# EAGLE design skypic-2005 (EAGLE 4.09)
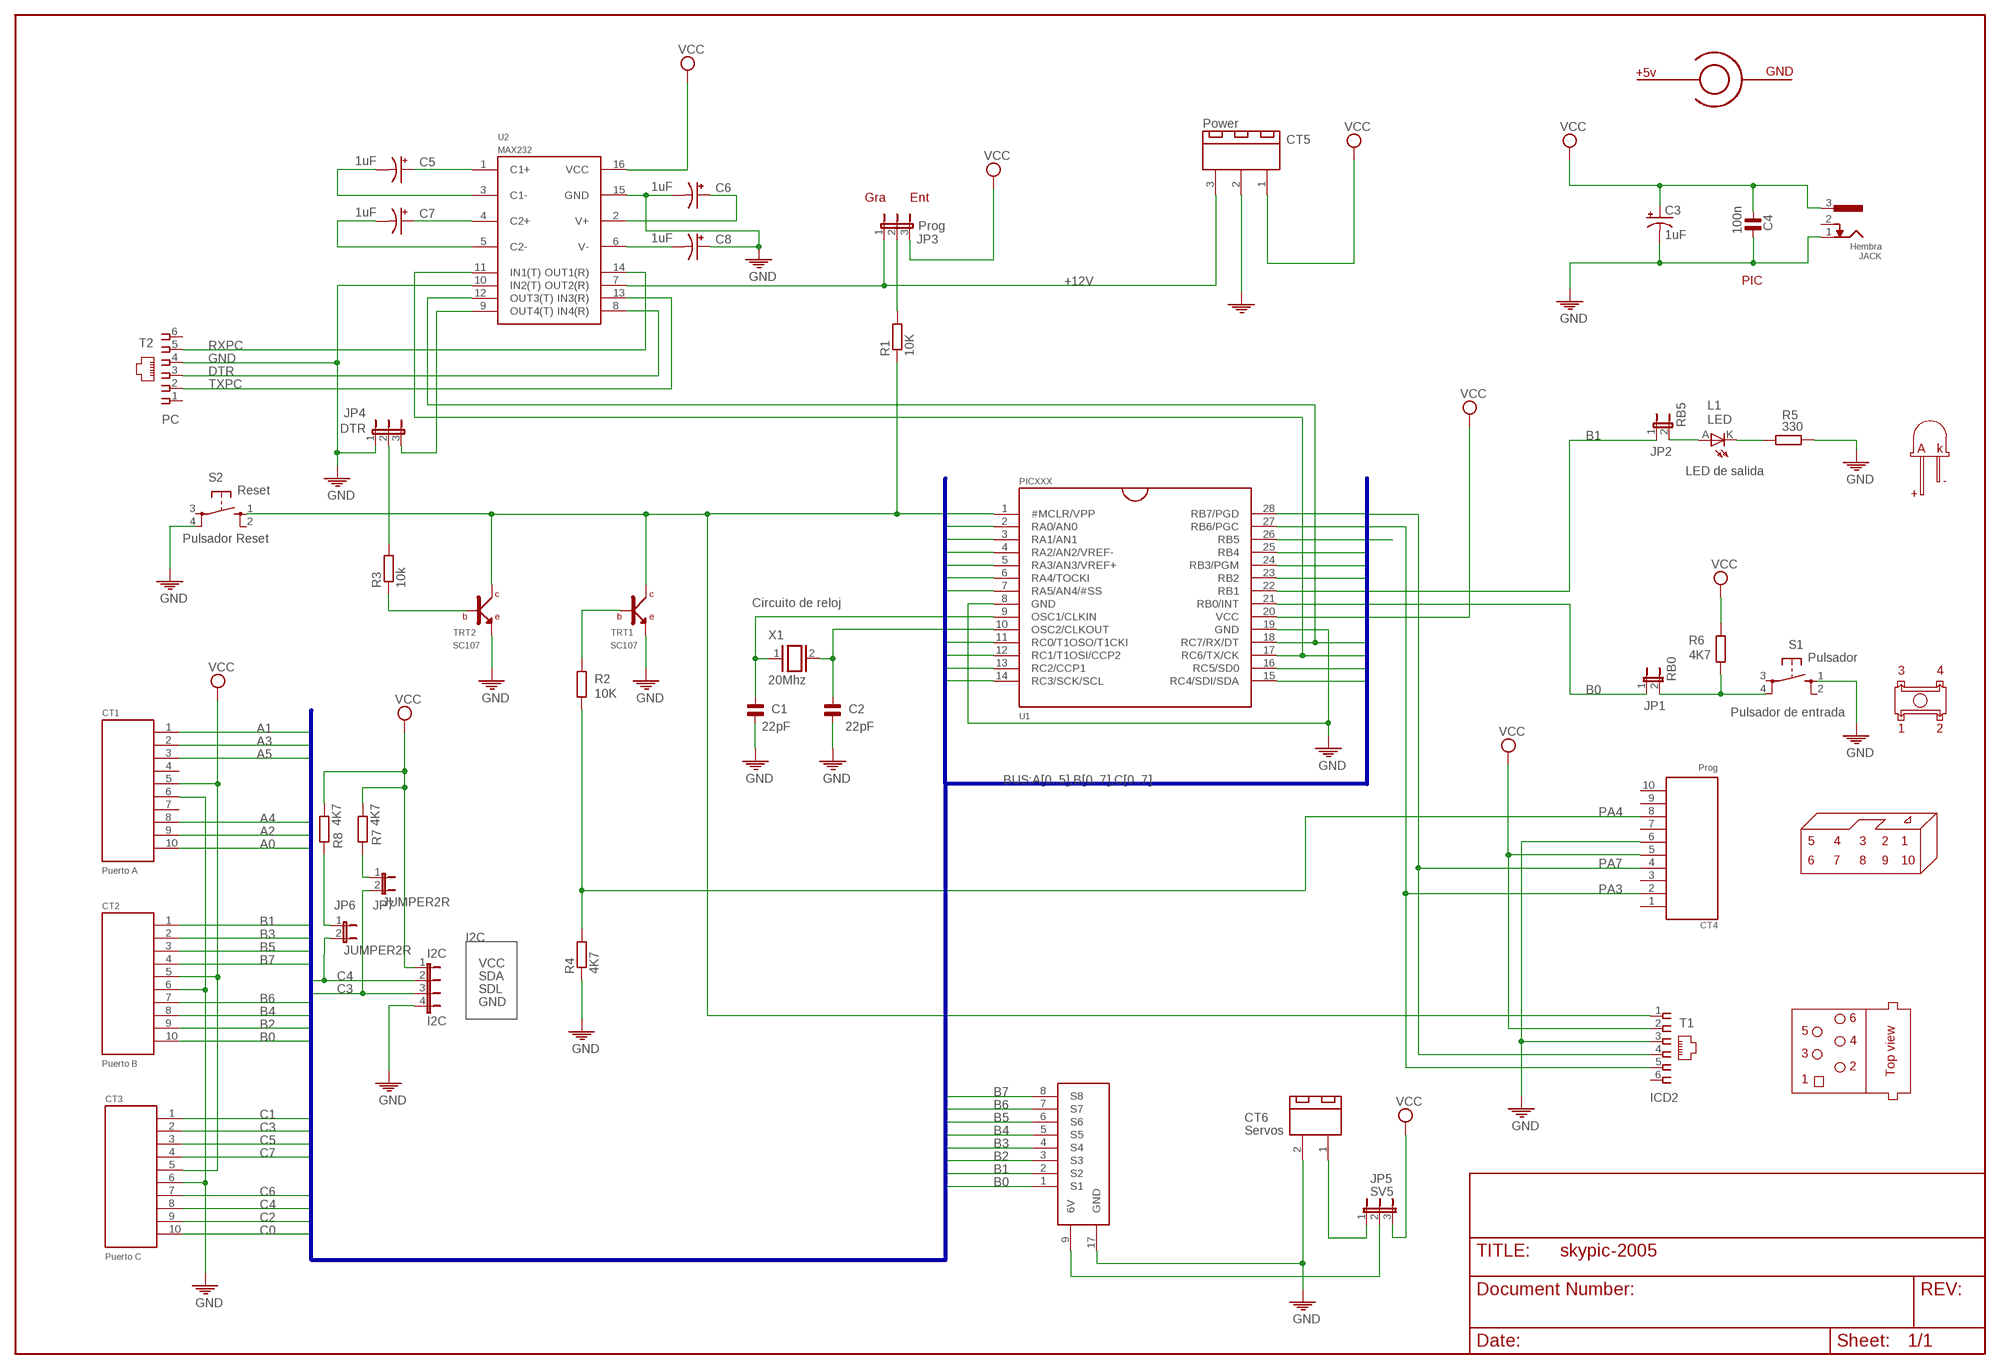
[diagram p0: schematic, sheet 1]

## Parts
C1  22pF  CON-MUL5  [C5]
C2  22pF  CON-MUL5  [C5]
C3  1uF  CPOL-USE2.5-6  [E2,5-6]
C4  100n  CON-MUL5  [C5]
C5  1uF  CPOL-USE2.5-6  [E2,5-6]
C6  1uF  CPOL-USE2.5-6  [E2,5-6]
C7  1uF  CPOL-USE2.5-6  [E2,5-6]
C8  1uF  CPOL-USE2.5-6  [E2,5-6]
CT1  Puerto A  CTCONA  [CTCON]
CT2  Puerto B  CTCONA  [CTCON]
CT3  Puerto C  CTCONA  [CTCON]
CT4  Prog  CTCONA  [CTCON]
CT5  Power  CLEMA3P  [C3P]
CT6  Servos  CLEMA2P  [C2P]
I2C  I2C  JUMPER4  [JP4R]
JACK  Hembra  JACKP  [JACK]
JP1  RB0  JUMPER2R  [JP2]
JP2  RB5  JUMPER2R  [JP2]
JP3  Prog  JUMPER3R  [JP3R]
JP4  DTR  JUMPER3R  [JP3R]
JP5  SV5  JUMPER3R  [JP3R]
JP6  JUMPER2R  [JP2]
JP7  JUMPER2R  [JP2]
L1  LED  LED3  [LED3MM]
PICXXX  U1  PIC16F876A  [DIL28]
R1  10K  RESISTENCIA10  [R207/10]
R2  10K  RESISTENCIA10  [R207/10]
R3  10k  RESISTENCIA10  [R207/10]
R4  4K7  RESISTENCIA10  [R207/10]
R5  330  RESISTENCIA10  [R207/10]
R6  4K7  RESISTENCIA10  [R207/10]
R7  4K7  RESISTENCIA10  [R207/10]
R8  4K7  RESISTENCIA10  [R207/10]
S1  Pulsador  PULSADORP  [PULSADOR-PEQUEÑO]
S2  Reset  PULSADORP  [PULSADOR-PEQUEÑO]
T1  ICD2  TEL6  [RJ11A]
T2  PC  TEL6  [RJ11A]
TRT1  SC107  SC107NPN  [TRT-NPN]
TRT2  SC107  SC107NPN  [TRT-NPN]
U2  MAX232  MAX232SDIP  [DIL16]
U$24  SERVOS8  [PAD8X3]
X1  20Mhz  XTALR  [XTAL-R]

## Nets
+12V: CT5.3 JP3.1 U2.7(OUT2(R))
A0: CT1.10 PICXXX.2(RA0/AN0)
A1: CT1.1 PICXXX.3(RA1/AN1)
A2: CT1.9 PICXXX.4(RA2/AN2/VREF-)
A3: CT1.2 PICXXX.5(RA3/AN3/VREF+)
A4: CT1.8 PICXXX.6(RA4/TOCKI)
A5: CT1.3 PICXXX.7(RA5/AN4/#SS)
B0: CT2.10 JP1.1 PICXXX.21(RB0/INT) U$24.1(S1)
B1: CT2.1 JP2.1 PICXXX.22(RB1) U$24.2(S2)
B2: CT2.9 PICXXX.23(RB2) U$24.3(S3)
B3: CT2.2 PICXXX.24(RB3/PGM) U$24.4(S4)
B4: CT2.8 PICXXX.25(RB4) U$24.5(S5)
B5: CT2.3 PICXXX.26(RB5) U$24.6(S6)
B6: CT2.7 CT4.2 PICXXX.27(RB6/PGC) T1.5 U$24.7(S7)
B7: CT2.4 CT4.4 PICXXX.28(RB7/PGD) T1.4 U$24.8(S8)
C0: CT3.10 PICXXX.11(RC0/T1OSO/T1CKI)
C1: CT3.1 PICXXX.12(RC1/T1OSI/CCP2)
C2: CT3.9 PICXXX.13(RC2/CCP1)
C3: CT3.2 I2C.3 JP7.2 PICXXX.14(RC3/SCK/SCL)
C4: CT3.8 I2C.2 JP6.2 PICXXX.15(RC4/SDI/SDA)
C5: CT3.3 PICXXX.16(RC5/SD0)
C6: CT3.7 PICXXX.17(RC6/TX/CK) U2.11(IN1(T))
C7: CT3.4 PICXXX.18(RC7/RX/DT) U2.12(OUT3(T))
DTR: T2.3 U2.8(IN4(R))
GND: C1.1 C2.1 C3.- C4.1 C6.- C8.+ CT1.6 CT2.6 CT3.6 CT4.6 CT5.2 CT6.2 I2C.4 JACK.1 JP4.1 PICXXX.8(GND) PICXXX.19(GND) R4.1 R5.1 S1.1 S2.4 T1.3 T2.4 TRT1.E TRT2.E U2.10(IN2(T)) U2.15(GND) U$24.17(GND)
N$1: C2.2 PICXXX.10(OSC2/CLKOUT) X1.2
N$2: JP7.1 R7.1
N$3: C1.2 PICXXX.9(OSC1/CLKIN) X1.1
N$4: JP1.2 R6.1 S1.4
N$5: JP4.3 U2.9(OUT4(T))
N$6: JP2.2 L1.A
N$8: JP3.2 R1.2
N$9: JP6.1 R8.1
N$10: R2.2 TRT1.B
N$13: C5.- U2.3(C1-)
N$14: C7.+ U2.4(C2+)
N$15: C5.+ U2.1(C1+)
N$16: C7.- U2.5(C2-)
N$18: C6.+ U2.2(V+)
N$19: C8.- U2.6(V-)
N$20: R3.1 TRT2.B
N$21: JP4.2 R3.2
N$23: L1.K(C) R5.2
N$24: PICXXX.1(#MCLR/VPP) R1.1 S2.1 T1.1 TRT1.C TRT2.C
N$25: CT6.1 JP5.1
N$27: JP5.2 U$24.9(6V)
PA4: CT4.8 R2.1 R4.2
RXPC: T2.5 U2.14(OUT1(R))
TXPC: T2.2 U2.13(IN3(R))
VCC: C3.+ C4.2 CT1.5 CT2.5 CT3.5 CT4.5 CT5.1 I2C.1 JACK.3 JP3.3 JP5.3 PICXXX.20(VCC) R6.2 R7.2 R8.2 T1.2 U2.16(VCC)
Unconnected: CT1.4 CT1.7 CT4.1 CT4.3 CT4.7 CT4.9 CT4.10 JACK.2 S1.2 S1.3 S2.2 S2.3 T1.6 T2.1 T2.6

## Buses
BUS:A[0..5],B[0..7],C[0..7]

## Notes on the sheet
- +5v | GND
- Gra | Ent
- PIC
- A | k
- LED de salida
- -
- +
- Pulsador Reset
- Circuito de reloj
- 3 | 4
- Pulsador de entrada
- 1 | 2
- 5 | 4 | 3 | 2 | 1
- PA7 | 6 | 7 | 8 | 9 | 10
- PA3
- I2C
- VCC
- SDA
- SDL
- GND
- 6
- 5
- 4
- 3
- 2
- Top view
- 1

## Library data of the parts
C1 C2 C4 = custom-2002:CON-MUL: Condensadores multicapa
C3 C5-C8 = rcl:CPOL-US: POLARIZED CAPACITOR, American symbol
CT1-CT4 = custom-2002:CTCON: Conector compatible CT
CT5 = custom-2002:CLEMA3: clema 3 entradas
CT6 = custom-2002:CLEMA2: Clema doble
I2C = custom-2005:JUMPER4
JACK = custom-2002:JACK: Jack alimentacion
JP1 JP2 = custom-2002:JUMPER2: jumper doble
JP3-JP5 = custom-2002:JUMPER3: jumper triple
JP6 JP7 = ifara2005:JUMPER2: jumper doble
L1 = custom-2002:LED: Diodo LED Anodo positivo (pata larga)
PICXXX = custom-2002:PIC16F876: Microcontrolador PIC16f876A
R1-R6 = custom-2002:RESISTENCIA: Resistencia
R7 R8 = ifara2005:RESISTENCIA: Resistencia de paso 10mm
S1 S2 = custom-2002:PULSADOR: Pulsador de circuito impreso
T1 T2 = custom-2002:TEL6
TRT1 TRT2 = custom-2002:SC107: SC107 y equivalente
U2 = custom-2002:MAX232: CONVERSOR RS232 - TTL
U$24 = custom-2002:SERVOS8: Conector para 8 servos futaba
X1 = custom-2002:XTAL: XTAL

## Board
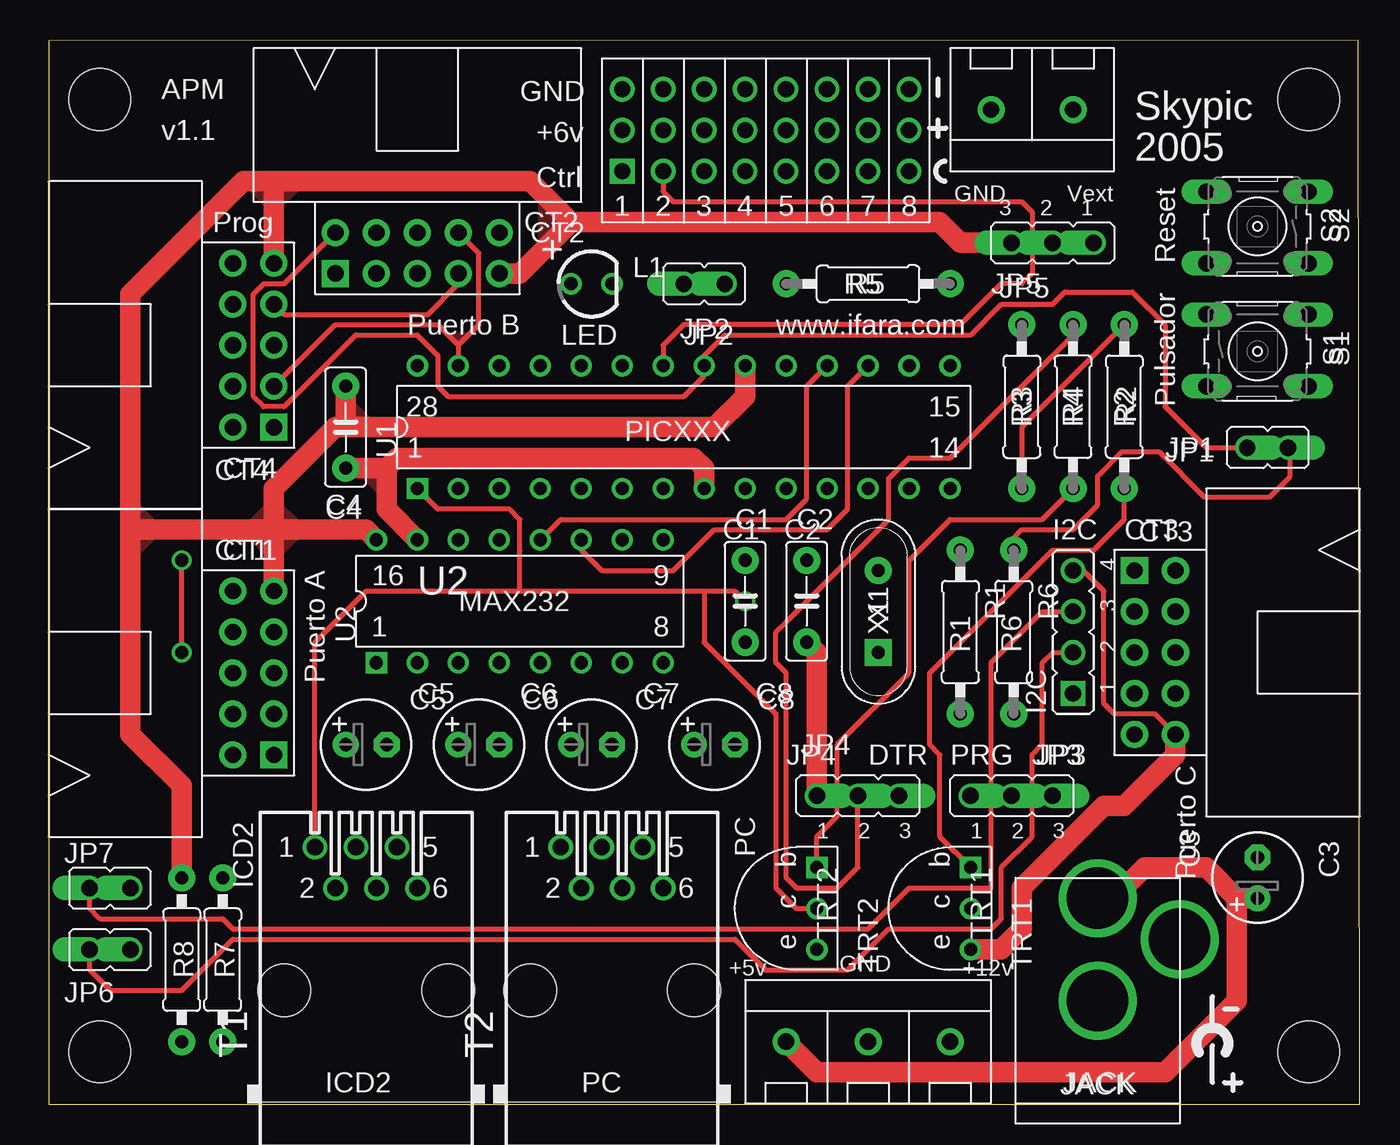
[diagram p1: board, top side]
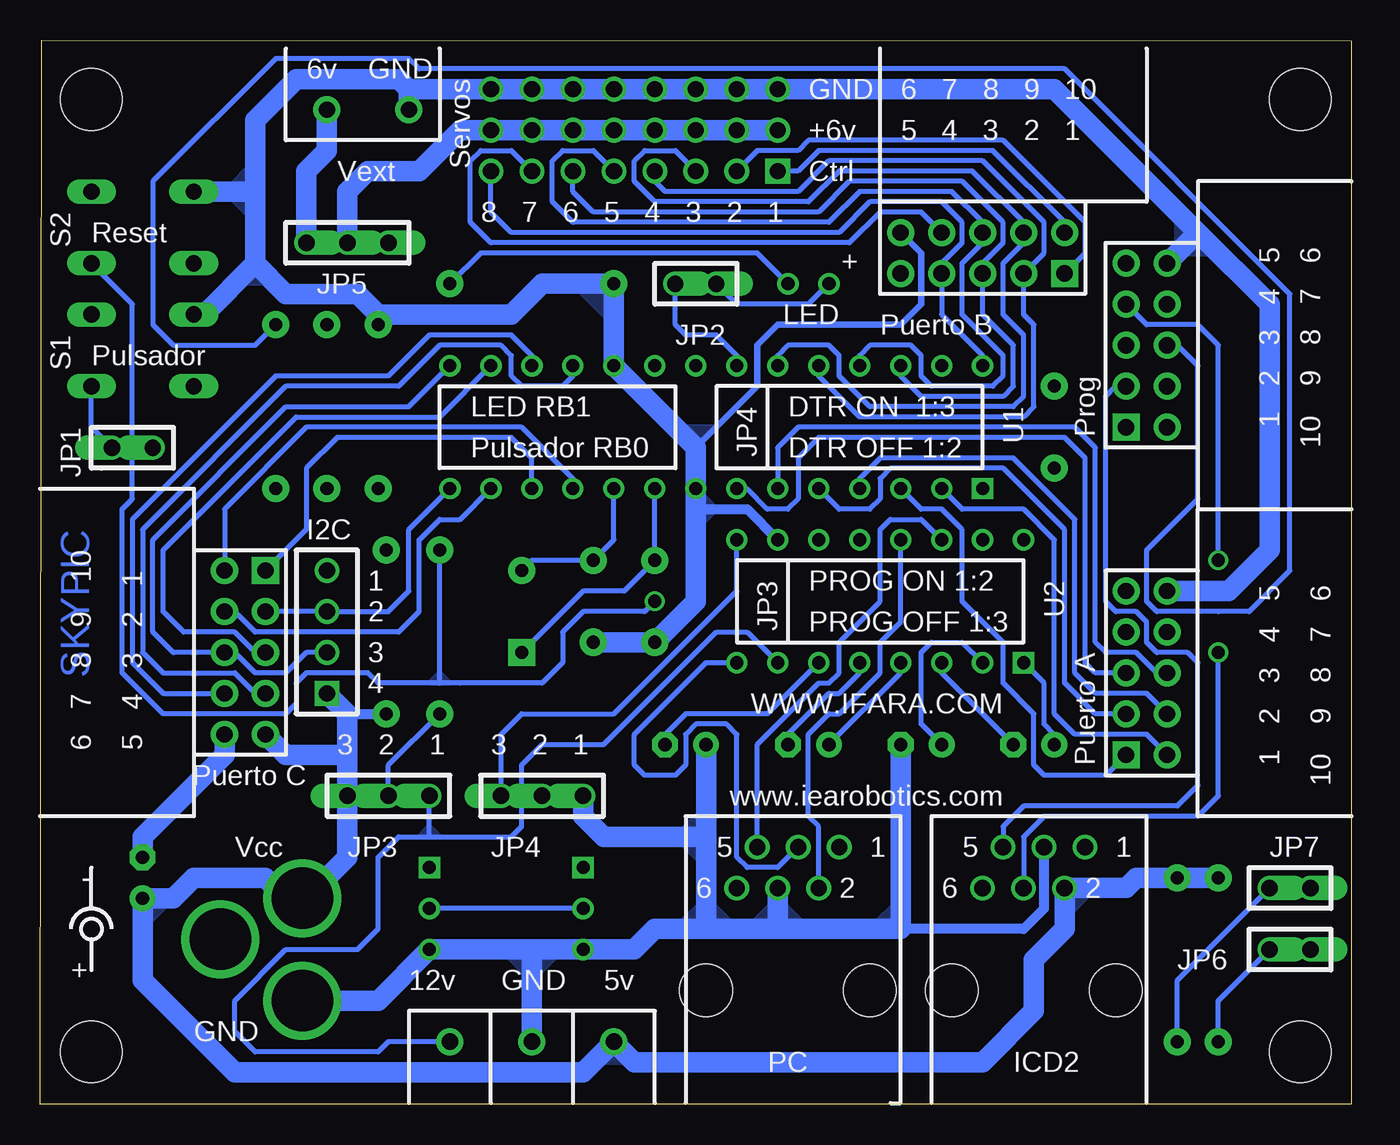
[diagram p2: board, bottom side, seen from below]

Size 81.26 x 65.99 mm. Coordinates in mm from the lower left corner, seen from the top.
Outline: 0,0 81.26,0 81.19,65.99 0,65.96 0,0
Copper layers used: Top, bottom
Holes 3.81 mm at 3.17,62.32 78.1,62.32 78.1,3.26 3.17,3.26

### Footprints (pad centres in the part's own frame; a part is rotated, then mirrored left to right if it is on the bottom)
C5 = drill 0.813 pad 1.676 round: 1 0,0; 2 5.08,0
E2,5-6 = drill 0.813 pad 1.6 round: + -1.27,0 | drill 0.813 pad 1.6 octagon: - 1.27,0
CTCON = drill 1.016 pad 1.676 square: 1 0,0 | drill 1.016 pad 1.676 round: 2 2.54,0; 3 5.08,0; 4 7.62,0; 5 10.16,0; 6 10.16,2.54; 7 7.62,2.54; 8 5.08,2.54; 9 2.54,2.54; 10 0,2.54
C3P = drill 1.016 pad 1.676 round: 1 0,0; 2 5.08,0; 3 10.16,0
C2P = drill 1.016 pad 1.676 round: 1 0,0; 2 5.08,0
JP4R = drill 1.016 square: 1 0,0 | drill 1.016 round: 2 2.54,0; 3 5.08,0; 4 7.62,0
JACK = drill 3.81 round: 1 0,-7.62; 2 5.08,-3.81; 3 0,-1.27
JP2 = drill 1.016 offset: 1 0,0; 2 2.54,0
JP3R = drill 1.016 offset: 1 0,0; 2 2.54,0; 3 5.08,0
JP2' = drill 1.016 offset: 1 -1.27,0; 2 1.27,0
LED3MM = drill 0.813 round: A 0,0; K 2.54,0
DIL28 = drill 0.813 square: 1 0,0 | drill 0.813 round: 2 2.54,0; 3 5.08,0; 4 7.62,0; 5 10.16,0; 6 12.7,0; 7 15.24,0; 8 17.78,0; 9 20.32,0; 10 22.86,0; 11 25.4,0; 12 27.94,0; 13 30.48,0; 14 33.02,0; 15 33.02,7.62; 16 30.48,7.62; 17 27.94,7.62; 18 25.4,7.62; 19 22.86,7.62; 20 20.32,7.62; 21 17.78,7.62; 22 15.24,7.62; 23 12.7,7.62; 24 10.16,7.62; 25 7.62,7.62; 26 5.08,7.62; 27 2.54,7.62; 28 0,7.62
R207/10 = drill 0.813 pad 1.676 round: 1 0,0; 2 10.16,0
R207/10' = drill 0.813 pad 1.676 round: 1 -5.08,0; 2 5.08,0
PULSADOR-PEQUEÑO = drill 1.016 long: 1 0,0; 2 6.35,0; 3 0,-4.445; 4 6.35,-4.445
RJ11A = drill 1.016 round: 1 0,0; 2 -1.27,2.54; 3 -2.54,0; 4 -3.81,2.54; 5 -5.08,0; 6 -6.35,2.54 | hole 3.251: 1.905,8.89; -8.255,8.89
TRT-NPN = drill 0.813 square: B 1.27,-1.27 | drill 0.813 round: C -1.27,-1.27; E -3.81,-1.27
DIL16 = drill 0.813 square: 1 0,0 | drill 0.813 round: 2 2.54,0; 3 5.08,0; 4 7.62,0; 5 10.16,0; 6 12.7,0; 7 15.24,0; 8 17.78,0; 9 17.78,7.62; 10 15.24,7.62; 11 12.7,7.62; 12 10.16,7.62; 13 7.62,7.62; 14 5.08,7.62; 15 2.54,7.62; 16 0,7.62
PAD8X3 = drill 1.016 square: 1 0,0 | drill 1.016 round: 2 2.54,0; 3 5.08,0; 4 7.62,0; 5 10.16,0; 6 12.7,0; 7 15.24,0; 8 17.78,0; 9 0,2.54; 10 2.54,2.54; 11 5.08,2.54; 12 7.62,2.54; 13 10.16,2.54; 14 12.7,2.54; 15 15.24,2.54; 16 17.78,2.54; 17 0,5.08; 18 2.54,5.08; 19 5.08,5.08; 20 7.62,5.08; 21 10.16,5.08; 22 12.7,5.08; 23 15.24,5.08; 24 17.78,5.08
XTAL-R = drill 0.813 pad 1.676 square: 1 0,0 | drill 0.813 pad 1.676 round: 2 5.08,0

### Placement (x,y rotation side)
C1  43.17,28.66 90 top
C2  46.98,28.66 90 top
C3  74.93,14.06 90 top
C4  18.41,39.46 90 top
C5  19.68,22.31 0 top
C6  26.67,22.31 0 top
C7  33.65,22.31 0 top
C8  41.27,22.31 0 top
CT1  13.96,21.68 90 top
CT2  17.78,51.52 0 top
CT3  67.31,33.11 270 top
CT4  13.96,42 90 top
CT5  45.71,3.9 0 top
CT6  63.49,61.68 180 top
I2C  63.49,25.49 90 top
JACK  65.02,14.06 0 top
JP1  74.29,40.73 0 top
JP2  41.9,50.89 180 top
JP3  57.14,19.14 0 top
JP4  47.62,19.14 0 top
JP5  64.77,53.43 180 top
JP6  JUMPER2R  [JP2']  3.81,9.61 180 top
JP7  JUMPER2R  [JP2']  3.81,13.42 180 top
L1  32.38,50.89 0 top
PICXXX  22.86,38.19 0 top
R1  56.51,34.38 270 top
R2  66.67,48.35 270 top
R3  63.49,38.19 90 top
R4  60.32,48.35 270 top
R5  45.71,50.89 0 top
R6  59.81,34.38 270 top
R7  4K7  [R207/10']  10.79,8.98 90 top
R8  4K7  [R207/10']  8.25,8.98 90 top
S1  71.75,48.98 0 top
S2  78.1,52.16 180 top
T1  16.51,15.96 180 top
T2  31.75,15.96 180 top
TRT1  55.88,13.42 90 top
TRT2  46.35,13.42 90 top
U2  20.32,27.39 0 top
U$24  35.55,57.87 0 top
X1  51.43,28.03 90 top

### Tracks (layer width: path | path; a pad name or v marks a point on that pad's centre or on a via)
+12V
  bottom 0.305: 57.14,16.6 52.06,16.6 51.43,17.23 51.43,21.04 50.16,22.31 46.35,22.31 39.36,29.3 37.46,29.3 U2.7 | 57.14,16.6 JP3.1 | CT5.3 59.68,3.9 60.32,3.26 67.94,3.26 69.21,4.53 69.21,6.44 66.04,9.61 61.59,9.61 60.32,10.88 60.32,11.52 60.32,15.33 59.05,16.6 57.14,16.6
  pour bottom: 57.14,17.23 56.51,16.6 57.78,16.6
A0
  bottom 0.305: CT1.10 12.69,22.95 17.14,22.95 18.41,24.22 18.41,35.01 20.32,36.92 24.12,36.92 PICXXX.2
A1
  bottom 0.305: CT1.1 15.23,20.41 19.05,20.41 19.68,21.04 19.68,24.22 21.59,26.12 21.59,28.66 24.12,31.2 24.12,35.65 25.39,36.92 26.67,36.92 PICXXX.3
A2
  bottom 0.305: CT1.9 12.69,25.49 15.87,25.49 17.14,26.76 17.14,36.28 20.95,40.09 29.21,40.09 30.48,38.82 PICXXX.4
A3
  bottom 0.305: CT1.2 15.87,24.22 17.78,26.12 17.78,35.65 21.59,39.46 28.57,39.46 29.21,38.82 29.21,37.55 29.84,36.92 31.75,36.92 PICXXX.5
A4
  bottom 0.305: CT1.8 12.06,26.76 13.33,28.03 15.23,28.03 15.87,28.66 15.87,40.73 17.14,42 34.28,42 35.55,40.73 PICXXX.6
A5
  bottom 0.305: CT1.3 15.87,26.76 16.51,27.39 16.51,40.09 17.78,41.36 33.02,41.36 34.28,40.09 34.28,37.55 34.92,36.92 36.19,36.92 37.46,38.19 PICXXX.7
B0
  Top 0.305: CT2.10 14.6,50.89 13.33,50.89 12.69,50.25 12.69,43.9 13.33,43.27 14.6,43.27 19.05,47.71 22.86,47.71 24.12,46.44 24.12,44.54 24.76,43.9 39.36,43.9 40.63,45.17 PICXXX.21 40.63,46.44 41.9,47.71 57.14,47.71 59.05,49.62 62.22,49.62 62.99,50.38 67.18,50.38 69.21,48.35 69.21,43.27 71.75,40.73 JP1.1
  bottom 0.305: CT2.10 17.78,54.7 22.22,59.14 33.02,59.14 34.28,57.87 U$24.1
B1
  Top 0.305: PICXXX.22 38.09,47.08 39.36,48.35 56.51,48.35 59.05,50.89 60.32,50.89 60.95,51.52 60.95,55.33 60.32,55.97 38.73,55.97 38.09,56.6 U$24.2
  bottom 0.305: CT2.1 16.51,52.79 16.51,54.7 21.59,59.78 33.65,59.78 34.28,59.14 36.82,59.14 U$24.2 | JP2.1 41.9,48.35 41.27,47.71 39.36,47.71 38.09,46.44 PICXXX.22
B2
  bottom 0.305: PICXXX.23 35.55,46.44 34.92,47.08 32.38,47.08 31.75,46.44 31.75,45.17 29.84,43.27 20.95,43.27 20.32,43.9 20.32,47.71 21.59,48.98 21.59,52.16 20.32,53.43 CT2.9 20.32,54.7 23.49,57.87 31.75,57.87 33.65,55.97 43.17,55.97 44.45,57.24 44.45,58.51 43.81,59.14 41.9,59.14 U$24.3
B3
  bottom 0.305: PICXXX.24 33.02,45.17 30.48,42.63 20.32,42.63 19.68,43.27 19.68,48.35 20.32,48.98 CT2.2 19.05,52.79 19.05,54.7 22.86,58.51 32.38,58.51 34.28,56.6 42.54,56.6 43.17,57.24 U$24.4
B4
  bottom 0.305: PICXXX.25 30.48,46.44 29.84,47.08 27.3,47.08 26.67,46.44 26.67,45.17 26.03,44.54 22.22,44.54 21.59,45.17 21.59,46.44 24.12,48.98 24.12,52.16 22.86,53.43 CT2.8 22.86,54.7 24.76,56.6 30.48,56.6 32.38,54.7 48.25,54.7 49.52,55.97 49.52,58.51 48.89,59.14 46.98,59.14 U$24.5
B5
  bottom 0.305: PICXXX.26 27.94,45.17 26.67,43.9 21.59,43.9 20.95,44.54 20.95,47.08 22.86,48.98 CT2.3 22.86,52.16 21.59,53.43 21.59,54.7 24.12,57.24 31.11,57.24 33.02,55.33 46.98,55.33 48.25,56.6 U$24.6
B6
  Top 0.305: CT4.2 17.78,48.35 24.12,48.35 25.39,47.08 | CT2.7 26.67,52.79 26.67,48.35 25.39,47.08 | 25.39,47.08 PICXXX.27
  bottom 0.305: CT2.7 26.67,55.33 29.21,55.33 31.11,53.43 53.34,53.43 54.6,54.7 54.6,58.51 53.97,59.14 52.06,59.14 U$24.7 | CT4.2 14.6,44.54 15.23,43.9 15.23,31.2 14.6,30.57 13.33,30.57 12.69,29.93 12.69,28.66 12.06,28.03 10.15,28.03 9.52,27.39 9.52,19.77 10.79,18.5 20.32,18.5 21.59,17.23 T1.5
  pour Top: 25.39,47.08 24.76,47.71 26.03,47.71
B7  (via drill 0.81)
  Top 0.305: CT4.4 14.6,48.98 23.49,48.98 25.39,50.89 CT2.4 | v8.25,28.03 v8.25,33.74
  bottom 0.305: PICXXX.28 22.86,46.44 25.39,48.98 CT2.4 25.39,52.16 24.12,53.43 24.12,54.7 25.39,55.97 29.84,55.97 31.75,54.06 52.06,54.06 53.34,55.33 U$24.8 | v8.25,28.03 8.25,19.14 9.52,17.87 19.05,17.87 20.32,16.6 T1.4 | v8.25,33.74 8.25,47.08 9.52,48.35 12.69,48.35 CT4.4
C0
  bottom 0.305: CT3.10 69.84,36.92 64.77,42 51.43,42 48.25,38.82 PICXXX.11
C1
  bottom 0.305: CT3.1 64.77,35.65 64.77,39.46 62.86,41.36 52.06,41.36 50.79,40.09 PICXXX.12
C2
  bottom 0.305: PICXXX.13 55.24,36.28 56.51,36.28 57.78,35.01 57.78,30.57 59.05,29.3 67.94,29.3 69.21,30.57 CT3.9
C3
  Top 0.305: JP7.2 2.54,12.15 3.17,11.52 10.79,11.52 11.42,10.88 50.79,10.88 53.34,13.42 58.41,13.42 58.41,27.39 61.59,30.57 I2C.3
  bottom 0.305: PICXXX.14 57.14,36.92 58.41,35.65 58.41,31.84 59.68,30.57 I2C.3 CT3.2
C4
  Top 0.305: JP6.2 2.54,8.34 3.81,7.07 8.25,7.07 11.42,10.25 42.54,10.25 44.45,8.34 49.52,8.34 52.06,10.88 58.41,10.88 59.05,11.52 59.05,14.69 60.95,16.6 60.95,21.68 61.59,22.31 61.59,27.39 62.22,28.03 I2C.2
  bottom 0.305: PICXXX.15 58.41,43.27 66.04,43.27 74.29,35.01 74.29,29.3 73.02,28.03 CT3.8 69.21,28.03 67.94,26.76 66.04,26.76 64.77,28.03 I2C.2
C5
  bottom 0.305: CT3.3 67.94,28.03 69.21,29.3 72.39,29.3 73.66,30.57 73.66,34.38 65.4,42.63 56.51,42.63 PICXXX.16
C6
  Top 0.305: U2.11 33.02,34.38 34.28,33.11 38.73,33.11 41.27,35.65 48.25,35.65 49.52,36.92 49.52,44.54 PICXXX.17
  bottom 0.305: CT3.7 73.66,25.49 75.56,27.39 75.56,36.28 66.67,45.17 59.68,45.17 57.14,47.71 52.06,47.71 50.79,46.44 PICXXX.17
C7
  Top 0.305: U2.12 31.75,36.28 45.71,36.28 46.98,37.55 46.98,44.54 PICXXX.18
  bottom 0.305: CT3.4 67.94,25.49 69.21,26.76 73.66,26.76 74.93,28.03 74.93,35.65 66.04,44.54 59.05,44.54 56.51,47.08 52.7,47.08 52.06,46.44 52.06,45.17 51.43,44.54 48.89,44.54 48.25,45.17 PICXXX.18
DTR
  bottom 0.305: U2.8 40,27.39 44.45,22.95 44.45,21.04 43.81,20.41 41.9,20.41 41.27,21.04 41.27,22.95 40.63,23.58 38.73,23.58 38.09,22.95 38.09,15.33 37.46,14.69 35.55,14.69 T2.3
GND
  Top 0.305: CT3.6 68.58,24.22 66.04,24.22 65.4,24.85 65.4,31.84 64.13,33.11 I2C.4
  Top 1.27: CT3.6 69.84,21.68 66.67,18.5 65.4,18.5 60.32,13.42 60.32,10.88 59.05,9.61 TRT1.E | JP4.1 47.62,28.03 C2.1 | 20.95,39.46 21.59,40.09 40,40.09 40.63,39.46 PICXXX.8 | 20.95,39.46 C4.1 | 20.95,39.46 20.95,36.92 U2.15
  bottom 0.406: CT2.6 26.67,52.79 26.67,49.62 27.94,48.35 35.55,48.35 36.82,47.08 36.82,44.54 40.63,40.73
  bottom 0.61: 27.94,10.88 20.32,10.88 19.05,12.15 T1.3 | U2.10 37.46,36.92 40.63,36.92
  bottom 1.27: 9.52,54.06 5.08,49.62 5.08,34.38 7.62,31.84 CT1.6 | 9.52,54.06 CT4.6 | 9.52,54.06 18.41,62.95 U$24.17 58.41,62.95 | 60.32,48.98 52.06,48.98 50.16,50.89 R5.1 PICXXX.19 40.63,40.73 PICXXX.8 40.63,36.92 40.63,31.2 C1.1 C2.1 | 40,10.88 43.17,10.88 44.45,9.61 TRT2.E 50.79,9.61 | 40,10.88 40,16.6 | 40,16.6 C8.+ | C6.- 27.94,10.88 35.55,10.88 | 35.55,10.88 40,10.88 | CT3.6 69.84,21.68 74.93,16.6 C3.- | 60.32,48.98 R4.1 | 60.32,48.98 61.59,50.25 66.04,50.25 67.94,52.16 | 58.41,62.95 59.05,63.59 65.4,63.59 67.94,61.05 67.94,56.6 | S1.1 71.12,48.98 67.94,52.16 | 58.41,62.95 CT6.2 | 35.55,10.88 T2.4 | 50.79,9.61 TRT1.E 60.32,6.44 JACK.1 | 40,16.6 46.35,16.6 47.62,17.87 JP4.1 | 67.94,52.16 67.94,56.6 | 67.94,56.6 S2.4 | 50.79,9.61 CT5.2
  pour bottom: 8.25,52.79 10.79,52.79 10.79,55.33
  pour bottom: 27.94,10.88 27.94,12.79 29.84,10.88
  pour bottom: 33.65,10.88 37.46,10.88 35.55,12.79
  pour bottom: 38.09,10.88 41.9,10.88 40,12.79
  pour bottom: 67.94,52.16 66.67,50.89 69.21,50.89
  pour bottom: 40.63,40.73 39.36,42 41.9,42
  pour bottom (no thermals): 40.63,38.19 39.36,36.92 40.63,35.65
  pour bottom (no thermals): 48.25,50.89 45.71,50.89 45.71,48.35
  pour Top (no thermals): 20.95,39.46 19.05,39.46 20.95,37.55
  pour bottom: 40,18.5 41.9,16.6 40,14.69
  pour bottom (no thermals): 67.94,56.6 69.84,56.6 67.94,54.7
  pour bottom (no thermals): 67.94,56.6 67.94,58.51 69.84,56.6
  pour bottom: 48.89,9.61 50.79,7.71 52.7,9.61
N$1
  bottom 0.305: X1.2 50.79,33.74 C2.2 45.71,35.01 PICXXX.10
N$2
  bottom 0.305: JP7.1 10.79,7.71 R7.1
N$3
  bottom 0.305: X1.1 47.62,31.84 45.08,31.84 C1.2 43.17,34.38 PICXXX.9
N$4
  Top 0.305: R6.1 59.81,35.14 60.32,35.65 63.49,35.65 65.02,37.17 65.02,38.95 66.54,40.48 68.83,40.48 71.62,37.68 75.69,37.68 76.96,38.95 76.96,40.48 76.83,40.6 JP1.2
  bottom 0.305: S1.4 78.1,42 JP1.2
N$5
  bottom 0.305: U2.9 38.09,31.84 45.71,24.22 51.43,24.22 52.7,22.95 JP4.3
N$6
  bottom 0.305: L1.A 33.65,49.62 38.09,49.62 JP2.2
N$8
  bottom 0.305: R1.2 59.68,21.04 JP3.2
N$9
  bottom 0.305: JP6.1 8.25,6.44 R8.1
N$10
  Top 0.305: R2.2 66.67,36.28 64.77,34.38 62.22,34.38 54.6,26.76 54.6,22.31 55.24,21.68 55.24,16.6 TRT1.B
N$13
  bottom 0.305: U2.3 25.39,26.76 C5.-
N$14
  bottom 0.305: U2.4 27.94,26.76 C7.+
N$15
  bottom 0.305: C5.+ 18.41,22.95 19.05,23.58 19.05,26.12 U2.1
N$16
  bottom 0.305: U2.5 30.48,26.76 31.75,25.49 32.38,25.49 34.92,22.95 C7.-
N$18
  bottom 0.305: U2.2 24.12,28.66 26.03,28.66 26.67,28.03 26.67,23.58 C6.+
N$19
  bottom 0.305: U2.6 36.19,24.22 41.27,24.22 42.54,22.95 C8.-
N$20
  Top 0.305: TRT2.B 47.62,16.6 48.89,17.87 48.89,22.31 53.34,26.76 53.34,33.74 55.88,36.28 61.59,36.28 R3.1
N$21
  Top 0.305: JP4.2 50.16,14.69 48.89,13.42 46.35,13.42 45.71,14.06 45.71,22.95 45.71,23.58 45.71,26.76 45.08,27.39 45.08,29.3 45.71,29.93 52.06,36.28 52.06,38.82 53.34,40.09 55.88,40.09 63.49,47.71 R3.2
N$23
  bottom 0.305: R5.2 53.97,52.79 36.82,52.79 L1.K
N$24  (via drill 0.81)
  Top 0.305: TRT2.C 46.35,12.15 45.08,13.42 45.08,24.22 40.63,28.66 40.63,31.84 | PICXXX.1 24.12,36.92 28.57,36.92 29.21,36.28 29.21,34.38 29.21,31.84 | 29.21,31.84 36.82,31.84 37.46,31.84 40.63,31.84 | 40.63,31.84 42.54,31.84 | 42.54,31.84 v43.17,31.2 | T1.1 16.51,28.66 19.68,31.84 29.21,31.84 | 29.21,31.84 30.48,31.84 29.21,31.84 | 40.63,31.84 42.54,31.84
  bottom 0.305: S2.1 75.56,49.62 75.56,37.55 76.2,36.92 76.2,26.76 73.66,24.22 66.04,24.22 65.4,24.85 65.4,26.12 64.77,26.76 60.95,26.76 60.32,26.12 56.51,26.12 | v43.17,31.2 43.81,30.57 47.62,30.57 48.89,29.3 48.89,27.39 50.16,26.12 55.24,26.12 56.51,26.12 | 56.51,26.12 R1.1 | TRT2.C TRT1.C
  pour bottom (no thermals): 55.88,26.12 56.51,26.76 57.14,26.12
N$25
  bottom 1.27: CT6.1 63.49,59.14 64.77,57.87 JP5.1
N$27
  bottom 1.27: JP5.2 62.22,56.6 60.95,57.87 57.78,57.87 55.24,60.41 U$24.9
PA4
  Top 0.305: R4.2 60.32,42 R2.1
  bottom 0.305: CT4.8 10.79,47.08 9.52,45.81 9.52,37.55 12.69,34.38 12.69,31.2 12.06,30.57 8.25,30.57 6.34,30.57 3.81,33.11 3.81,50.25 17.78,64.22 57.78,64.22 58.41,64.86 66.67,64.86 74.29,57.24 74.29,48.35 73.02,47.08 67.94,47.08 R2.1
RXPC
  bottom 0.305: U2.14 26.67,36.28 28.57,36.28 29.21,35.65 29.21,31.2 31.75,28.66 31.75,26.76 32.38,26.12 33.02,26.12 36.82,22.31 T2.5
TXPC
  bottom 0.305: U2.13 27.94,29.93 29.21,28.66 29.21,26.76 31.75,24.22 32.38,24.22 33.65,22.95 33.65,17.87 33.02,17.23 T2.2
VCC
  Top 1.27: 64.77,12.79 66.04,12.79 67.94,14.69 71.75,14.69 73.66,12.79 | 73.66,12.79 73.66,6.44 69.21,1.99 47.62,1.99 CT5.1 | 73.66,12.79 C3.+ | 13.96,57.24 CT4.5 | 32.38,54.7 29.84,57.24 13.96,57.24 | 32.38,54.7 55.24,54.7 56.51,53.43 JP5.3 | 32.38,54.7 29.21,51.52 CT2.5 | 18.41,42 17.78,42 13.96,38.19 13.96,35.65 | 18.41,42 41.27,42 43.17,43.9 PICXXX.20 | CT1.5 13.96,35.65 | 13.96,35.65 19.68,35.65 U2.16 | 13.96,57.24 12.06,57.24 5.08,50.25 5.08,35.65 | 18.41,42 C4.2 | 5.08,35.65 5.08,22.95 8.25,19.77 R8.2 | 5.08,35.65 13.33,35.65
  bottom 0.61: 64.77,12.79 JACK.3 65.4,12.79 | 62.22,24.22 R6.2
  bottom 1.27: 62.22,21.68 62.22,24.22 I2C.1 | 62.22,21.68 JP3.3 62.22,15.33 64.77,12.79 65.4,12.79 66.04,12.79 67.31,14.06 71.75,14.06 73.02,12.79 C3.+ 74.93,7.71 69.21,1.99 47.62,1.99 CT5.1 44.45,2.63 22.86,2.63 19.68,5.8 19.68,8.98 17.78,10.88 T1.2 13.96,13.42 13.33,14.06 R7.2 R8.2 | 62.22,21.68 66.04,21.68 CT3.5
  pour Top: 32.38,54.7 30.48,56.6 30.48,52.79
  pour Top: 12.06,57.24 13.96,55.33 15.87,57.24
  pour Top: 12.06,35.65 13.96,33.74 15.87,35.65 13.96,37.55
  pour Top: 18.41,43.27 18.41,42 20.32,42 18.41,43.9
  pour bottom (no thermals): 15.87,13.42 17.78,13.42 17.78,11.52
  pour bottom: 44.45,2.63 45.71,3.9 46.98,2.63
  pour Top (no thermals): 5.08,33.74 6.98,35.65 5.08,35.65
  pour Top (no thermals): 5.08,35.65 5.08,37.55 6.98,35.65
  pour bottom (no thermals): 73.02,12.79 74.93,10.88 74.93,12.79

### Text on the board
bottom: SKYPIC
tPlace: APM | Skypic | v1.1 | 2005 | GND | Vext | Prog | CT2 | S2 | + | Reset | R5 | JP5 | Puerto B | www.ifara.com | LED | JP2 | S1 | Pulsador | R3 | R4 | R2 | U1 | JP1 | CT4 | C4 | C1 | C2 | I2C | CT3 | CT1 | MAX232 | X1 | U2 | R1 | R6 | Puerto A | C5 | C6 | C7 | C8 | JP4 | DTR | PRG | JP3 | Puerto C | PC | C3 | ICD2 | TRT2 | TRT1 | +5v | GND | +12v | ICD2 | PC | JACK
bPlace: Servos | GND | 6v | 10 | 9 | 8 | 7 | 6 | GND | 1 | 2 | 3 | 4 | 5 | +6v | Ctrl | Vext | 1 | 2 | 3 | 4 | 5 | 6 | 7 | 8 | S2 | + | Reset | 6 | 5 | 7 | 4 | LED | JP5 | Puerto B | S1 | 8 | 3 | JP2 | Pulsador | Prog | 9 | 2 | U1 | DTR ON 1:3 | JP4 | LED RB1 | 1 | JP1 | 10 | DTR OFF 1:2 | Pulsador RB0 | I2C | 10 | 1 | U2 | PROG ON 1:2 | JP3 | 1 | 6 | 5 | 2 | 2 | 9 | 7 | 4 | PROG OFF 1:3 | Puerto A | 3 | 8 | 3 | 8 | 3 | WWW.IFARA.COM | 4 | 4 | 7 | 9 | 2 | 5 | 6 | 1 | 2 | 3 | 1 | 2 | 3 | 1 | Puerto C | 10 | www.iearobotics.com | JP7 | 1 | 5 | 1 | 5 | JP4 | JP3 | Vcc | 2 | 6 | 2 | 6 | - | JP6 | + | 5v | GND | 12v | GND | ICD2 | PC